# Altium schematic sheet Top_Sheet.SchDoc
size A4; SheetNumber: 1; SheetTotal: 5
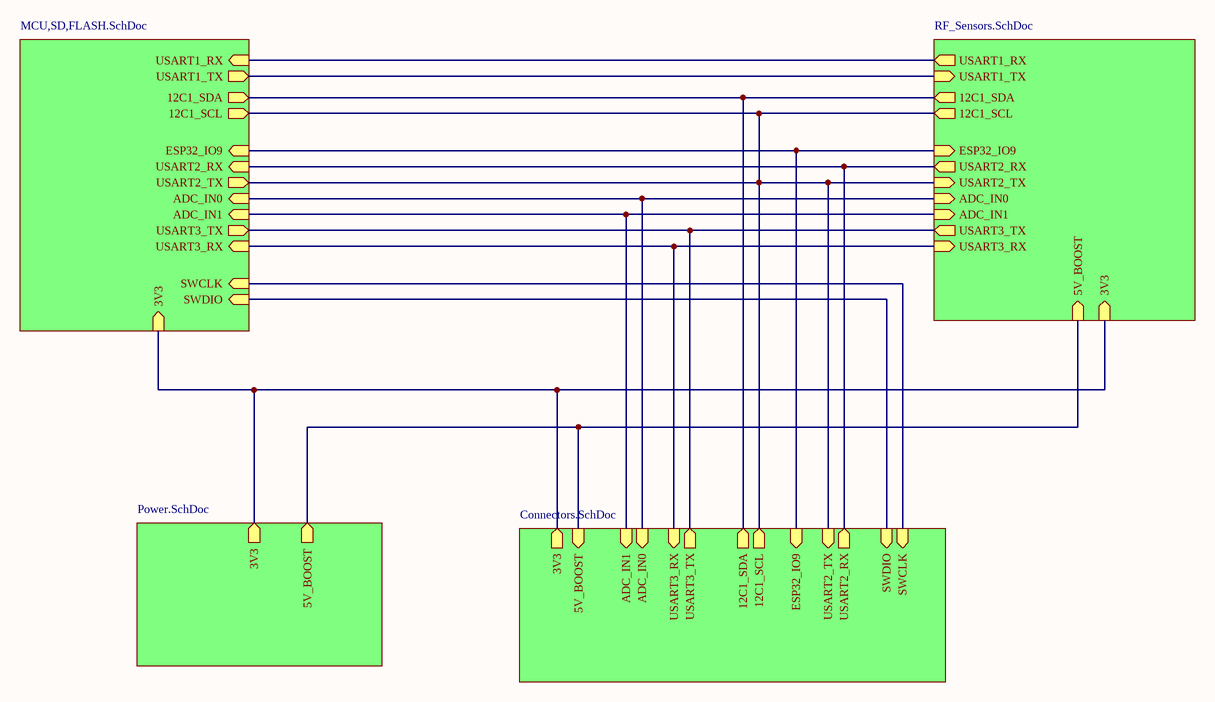
[diagram p0: Top_Sheet.SchDoc]

## Sub-sheets
U_Connectors = Connectors.SchDoc: 12C1_SDA (out), ADC_IN0 (in), ADC_IN1 (in), 3V3 (out), USART3_TX (out), USART3_RX (in), 5V_BOOST (in), 12C1_SCL (out), ESP32_IO9 (in), USART2_TX (in), USART2_RX (out), SWDIO (in), SWCLK (in)
U_MCU,SD,FLASH = MCU,SD,FLASH.SchDoc: USART1_TX (out), USART2_RX (in), ESP32_IO9 (in), 3V3 (in), 12C1_SCL (out), 12C1_SDA (out), USART3_TX (out), USART3_RX (in), ADC_IN0 (in), ADC_IN1 (in), USART2_TX (out), USART1_RX (in), SWDIO (in), SWCLK (in)
U_Power = Power.SchDoc: 3V3 (out), 5V_BOOST (out)
U_RF_Sensors = RF_Sensors.SchDoc: USART1_TX (in), USART1_RX (out), USART2_TX (in), USART2_RX (out), ESP32_IO9 (in), 12C1_SCL (out), 12C1_SDA (out), ADC_IN0 (in), ADC_IN1 (in), 3V3 (in), USART3_TX (out), USART3_RX (in), 5V_BOOST (in)

## Nets
(unnamed): sheet U_Power/3V3, sheet U_RF_Sensors/3V3, sheet U_MCU,SD,FLASH/3V3, sheet U_Connectors/3V3
(unnamed): sheet U_Power/5V_BOOST, sheet U_RF_Sensors/5V_BOOST, sheet U_Connectors/5V_BOOST
(unnamed): sheet U_RF_Sensors/USART1_TX, sheet U_MCU,SD,FLASH/USART1_TX
(unnamed): sheet U_RF_Sensors/USART1_RX, sheet U_MCU,SD,FLASH/USART1_RX
(unnamed): sheet U_RF_Sensors/USART2_TX, sheet U_RF_Sensors/12C1_SCL, sheet U_MCU,SD,FLASH/12C1_SCL, sheet U_MCU,SD,FLASH/USART2_TX, sheet U_Connectors/12C1_SCL, sheet U_Connectors/USART2_TX
(unnamed): sheet U_RF_Sensors/USART2_RX, sheet U_MCU,SD,FLASH/USART2_RX, sheet U_Connectors/USART2_RX
(unnamed): sheet U_RF_Sensors/ESP32_IO9, sheet U_MCU,SD,FLASH/ESP32_IO9, sheet U_Connectors/ESP32_IO9
(unnamed): sheet U_RF_Sensors/12C1_SDA, sheet U_MCU,SD,FLASH/12C1_SDA, sheet U_Connectors/12C1_SDA
(unnamed): sheet U_RF_Sensors/ADC_IN0, sheet U_MCU,SD,FLASH/ADC_IN0, sheet U_Connectors/ADC_IN0
(unnamed): sheet U_RF_Sensors/ADC_IN1, sheet U_MCU,SD,FLASH/ADC_IN1, sheet U_Connectors/ADC_IN1
(unnamed): sheet U_RF_Sensors/USART3_TX, sheet U_MCU,SD,FLASH/USART3_TX, sheet U_Connectors/USART3_TX
(unnamed): sheet U_RF_Sensors/USART3_RX, sheet U_MCU,SD,FLASH/USART3_RX, sheet U_Connectors/USART3_RX
(unnamed): sheet U_MCU,SD,FLASH/SWDIO, sheet U_Connectors/SWDIO
(unnamed): sheet U_MCU,SD,FLASH/SWCLK, sheet U_Connectors/SWCLK